# EAGLE design strain (EAGLE 9.2.2)
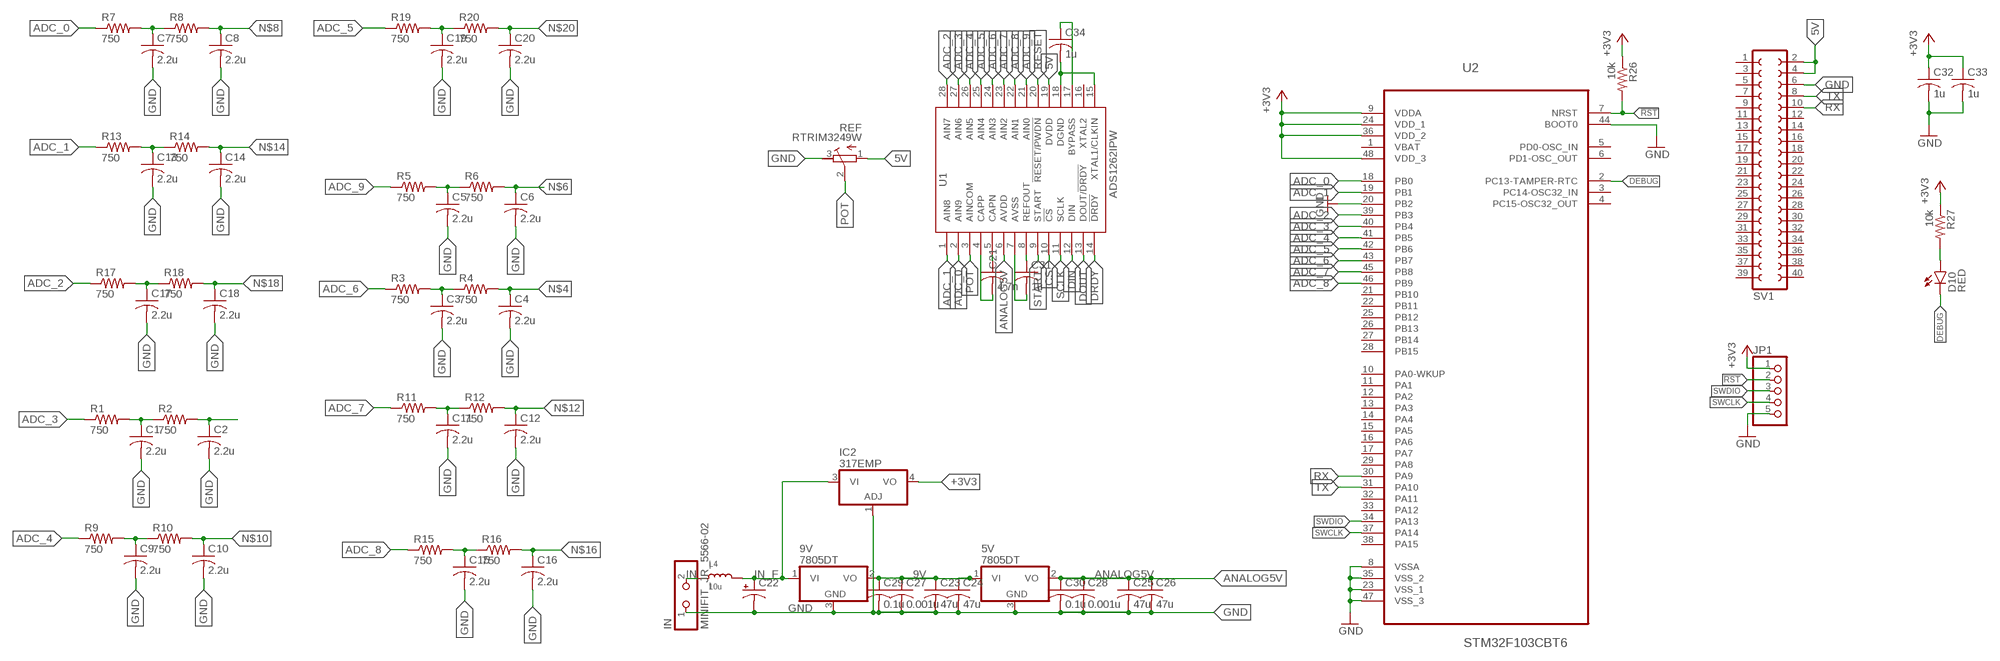
[diagram p0: schematic, sheet 1]

## Parts
5V  7805DT  [TO252]
9V  7805DT  [TO252]
C1  2.2u  C-USC0805  [C0805]
C2  2.2u  C-USC0805  [C0805]
C3  2.2u  C-USC0805  [C0805]
C4  2.2u  C-USC0805  [C0805]
C5  2.2u  C-USC0805  [C0805]
C6  2.2u  C-USC0805  [C0805]
C7  2.2u  C-USC0805  [C0805]
C8  2.2u  C-USC0805  [C0805]
C9  2.2u  C-USC0805  [C0805]
C10  2.2u  C-USC0805  [C0805]
C11  2.2u  C-USC0805  [C0805]
C12  2.2u  C-USC0805  [C0805]
C13  2.2u  C-USC0805  [C0805]
C14  2.2u  C-USC0805  [C0805]
C15  2.2u  C-USC0805  [C0805]
C16  2.2u  C-USC0805  [C0805]
C17  2.2u  C-USC0805  [C0805]
C18  2.2u  C-USC0805  [C0805]
C19  2.2u  C-USC0805  [C0805]
C20  2.2u  C-USC0805  [C0805]
C21  4.7n  C-USC0805  [C0805]
C22  CPOL-USE5-10.5  [E5-10,5]
C23  47u  C-USC1210  [C1210]
C24  47u  C-USC1210  [C1210]
C25  47u  C-USC1210  [C1210]
C26  47u  C-USC1210  [C1210]
C27  0.001u  C-USC0603  [C0603]
C28  0.001u  C-USC0603  [C0603]
C29  0.1u  C-USC0603  [C0603]
C30  0.1u  C-USC0603  [C0603]
C31  1u  C-USC0805  [C0805]
C32  1u  C-USC0805  [C0805]
C33  1u  C-USC0805  [C0805]
C34  1u  C-USC0805  [C0805]
D10  RED  LED-RED0603  [LED-0603]
IC2  317EMP  [SOT223]
IN  MINIFIT_JR_5566-02  [MINIFIT_JR_5566-02]
JP1  PINHD-1X5  [1X05]
L4  10u  INDUCTORNR5040  [INDUCTOR_5X5MM_NR5040_NOTHERMALS]
R1  750  R-US_R0805  [R0805]
R2  750  R-US_R0805  [R0805]
R3  750  R-US_R0805  [R0805]
R4  750  R-US_R0805  [R0805]
R5  750  R-US_R0805  [R0805]
R6  750  R-US_R0805  [R0805]
R7  750  R-US_R0805  [R0805]
R8  750  R-US_R0805  [R0805]
R9  750  R-US_R0805  [R0805]
R10  750  R-US_R0805  [R0805]
R11  750  R-US_R0805  [R0805]
R12  750  R-US_R0805  [R0805]
R13  750  R-US_R0805  [R0805]
R14  750  R-US_R0805  [R0805]
R15  750  R-US_R0805  [R0805]
R16  750  R-US_R0805  [R0805]
R17  750  R-US_R0805  [R0805]
R18  750  R-US_R0805  [R0805]
R19  750  R-US_R0805  [R0805]
R20  750  R-US_R0805  [R0805]
R26  10k  R-US_R0603  [R0603]
R27  10k  R-US_R0603  [R0603]
REF  RTRIM3249W  [RTRIM3299W]
SV1  FE20-2  [FE20-2]
U1  ADS1262IPW  [TSSOP28]
U2  STM32F103CBT6  [QFP50P900X900X160-48N]

## Nets
5V: REF.1(A) SV1.2 SV1.4 U1.19(DVDD)
9V: 5V.1(VI) 9V.2(VO) C23.1 C24.1 C27.1 C29.1
!RST: JP1.2 R26.2 U2.7(NRST)
+3V3 [PWR]: C32.1 C33.1 IC2.4(VO) JP1.1 R26.1 R27.1 U2.9(VDDA) U2.24(VDD_1) U2.36(VDD_2) U2.48(VDD_3)
ADC_0: R7.1 U1.2(AIN9) U2.18(PB0)
ADC_1: R13.1 U1.1(AIN8) U2.19(PB1)
ADC_2: R17.1 U1.28(AIN7) U2.39(PB3)
ADC_3: R1.1 U1.27(AIN6) U2.40(PB4)
ADC_4: R9.1 U1.26(AIN5) U2.41(PB5)
ADC_5: R19.1 U1.25(AIN4) U2.42(PB6)
ADC_6: R3.1 U1.24(AIN3) U2.43(PB7)
ADC_7: R11.1 U1.23(AIN2) U2.45(PB8)
ADC_8: R15.1 U1.22(AIN1) U2.46(PB9)
ADC_9: R5.1 U1.21(AIN0)
ANALOG5V: 5V.2(VO) C25.1 C26.1 C28.1 C30.1 U1.6(AVDD)
CS: U1.10(!CS)
DEBUG: D10.C U2.2(PC13-TAMPER-RTC)
DGND: C34.2 U1.15(XTAL1/CLKIN) U1.18(DGND)
DIN: U1.12(DIN)
DOUT: U1.13(DOUT/!DRDY)
DRDY: U1.14(!DRDY)
GND: 5V.3(GND) 9V.3(GND) C1.2 C2.2 C3.2 C4.2 C5.2 C6.2 C7.2 C8.2 C9.2 C10.2 C11.2 C12.2 C13.2 C14.2 C15.2 C16.2 C17.2 C18.2 C19.2 C20.2 C22.- C23.2 C24.2 C25.2 C26.2 C27.2 C28.2 C29.2 C30.2 C32.2 C33.2 IC2.1(ADJ) IN.1 JP1.5 REF.3(E) SV1.6 U2.8(VSSA) U2.20(PB2) U2.23(VSS_1) U2.35(VSS_2) U2.44(BOOT0) U2.47(VSS_3)
IN: IN.2 L4.P$1
IN_F: 9V.1(VI) C22.+ IC2.3(VI) L4.P$2
N$1: C1.1 R1.2 R2.1
N$2: C2.1 R2.2
N$3: C3.1 R3.2 R4.1
N$4: C4.1 R4.2
N$5: C5.1 R5.2 R6.1
N$6: C6.1 R6.2
N$7: C7.1 R7.2 R8.1
N$8: C8.1 R8.2
N$9: C9.1 R9.2 R10.1
N$10: C10.1 R10.2
N$11: C11.1 R11.2 R12.1
N$12: C12.1 R12.2
N$13: C13.1 R13.2 R14.1
N$14: C14.1 R14.2
N$15: C15.1 R15.2 R16.1
N$16: C16.1 R16.2
N$17: C17.1 R17.2 R18.1
N$18: C18.1 R18.2
N$19: C19.1 R19.2 R20.1
N$20: C20.1 R20.2
N$21: D10.A R27.2
N$22: C21.1 C21.2 U1.4(CAPP) U1.5(CAPN)
N$23: C31.1 U1.8(REFOUT)
N$24: C31.2 U1.7(AVSS)
N$25: C34.1 U1.17(BYPASS)
POT: REF.2(S) U1.3(AINCOM)
RESET: U1.20(!RESET/PWDN)
RX: SV1.10 U2.30(PA9)
SCLK: U1.11(SCLK)
START: U1.9(START)
SWCLK: JP1.4 U2.37(PA14)
SWDIO: JP1.3 U2.34(PA13)
TX: SV1.8 U2.31(PA10)
Unconnected: SV1.1 SV1.3 SV1.5 SV1.7 SV1.9 SV1.11 SV1.12 SV1.13 SV1.14 SV1.15 SV1.16 SV1.17 SV1.18 SV1.19 SV1.20 SV1.21 SV1.22 SV1.23 SV1.24 SV1.25 SV1.26 SV1.27 SV1.28 SV1.29 SV1.30 SV1.31 SV1.32 SV1.33 SV1.34 SV1.35 SV1.36 SV1.37 SV1.38 SV1.39 SV1.40 U1.16(XTAL2) U2.1(VBAT) U2.3(PC14-OSC32_IN) U2.4(PC15-OSC32_OUT) U2.5(PD0-OSC_IN) U2.6(PD1-OSC_OUT) U2.10(PA0-WKUP) U2.11(PA1) U2.12(PA2) U2.13(PA3) U2.14(PA4) U2.15(PA5) U2.16(PA6) U2.17(PA7) U2.21(PB10) U2.22(PB11) U2.25(PB12) U2.26(PB13) U2.27(PB14) U2.28(PB15) U2.29(PA8) U2.33(PA12) U2.38(PA15)

## Power pins joined to a net without a drawn wire
PA11: U2.32(PA11)

## Library data of the parts
5V 9V = linear:78*: Positive VOLTAGE REGULATOR Source: http://cache.national.com/ds/LM/LM78L05.pdf http://www.fairchildsemi.com/ds/LM/LM7805.pdf
C1-C21 C23-C34 = rcl:C-US: CAPACITOR, American symbol; SPICEPREFIX: C
C22 = rcl:CPOL-US: POLARIZED CAPACITOR, American symbol; SPICEPREFIX: C
D10 = SparkFun-LED:LED-RED: Assorted Red LEDs LilyPad 1206- DIO-09912 1206- DIO-00809 0603- DIO-00819 "SMART" means more efficient and expensive; PROD_ID: DIO-00819
IC2 = linear:*317: Positive VOLTAGE REGULATOR
IN = Display_Custom:MINIFIT_JR_5566-02: Molex Minifit JR 5566-02 Vertical 2 position headder https://www.molex.com/pdm_docs/sd/039293026_sd.pdf
JP1 = Headers_IFE:PINHD-1X5: PIN HEADER
L4 = microbuilder:INDUCTOR: Inductors 0603: 10nH Ceramic Inductor - microwire antenna/RF (Digikey: 712-1434-2-ND) 0805: 560nH Ceramic Inductor - RF (Digikey: 553-1047-1-ND) 270nH Ceramic Inductor - Q = 40@250MHz, +-5%, 1 Ohm DC Resistance (Digikey: 535-10506-2-ND) 1007 (2518 Metric) SMT: 10µH 10% 250mOhm 820mA 1007 Inductor (Digikey: 587-2189-1-ND) 22µH 10% 500mOhm 580mA 1007 Inductor (Digikey: 587-2190-1-ND) 47µH 10% 950mOhm 420mA 1007 Inductor (Digikey: 587-2191-1-ND) 47µH 5% 100mOhm 1A 1008 Inductor (Digikey: 732-1816-1-ND) 5.0x5.0mm (Taiyo Yuden NR5040 Series) 6.8µH 20% 2.3A 64mOhm Inductor (Digikey: 587-2374-2-ND) 5.0x5.0mm (TDK VLC5045 Series) 4.7µH 20% 3.3A 34mOhm Inductor (Digikey: 445-6526-1-ND) 6.8µH 20% 2.7A 46mOhm Inductor (Digikey: 445-6527-1-ND) 6.0x6.0mm (TDK VLC6045 Series) 4.7µH 20% 3.8A 27mOhm Inductor (Digikey: 445-6538-2-ND) 6.8µH 20% 3A 41mOhm Inductor (Digikey: 445-6540-1-ND) 6.2µH 30% 2.2A 45mOhm Inductor (Digikey: SRR5028-6R2YCT-ND) - Not TDK VLC6045 but footprint should match 6.0x6.0mm (TDK SLF6045 Series) 6.8uH 30% 2A 33mOhm Inductor (Digikey: 445-4572-1-ND, Mouser: 810-SLF645T6R8N2R0PF) 6.0x6.0mm (Sumida CDRH5D28 Series) 6.2uH 30% 1.8A 45mOhm Inductor (Digikey: 308-1542-1-ND) Taiyo Yuden NR3015T2R2M - 2.2uH 20% 1.5A (Digikey: 587-1648-2-ND, Mouser: 963-NR3015T2R2M) - Used with TI TPS62172 CoilCraft RFID Transponder Coil - MA5532-AE (For use with AS3935 Lightning Sensor)
R1-R20 R26 R27 = rcl:R-US_: RESISTOR, American symbol; SPICEPREFIX: R
REF = Resistors:RTRIM3249W
SV1 = con-lsta:FE20-2: FEMALE HEADER; OC_FARNELL: unknown; OC_NEWARK: unknown
U1 = ads1262:ADS1262: ADS126x 32-Bit, Precision, 38-kSPS, Analog-to-Digital Converter (ADC) with Programmable Gain Amplifier (PGA) and Voltage Reference Texas Instruments selon http://www.ti.com/lit/gpn/ads1262 by HN2015
U2 = ST Microelctronics_By_element14_Batch_1:STM32F103CBT6: Medium-density performance line ARM-based 32-bit MCU; MPN: STM32F103CBT6; OC_FARNELL: 1606327; OC_NEWARK: 11N8296; PACKAGE: QFP-48; SUPPLIER: STMICROELECTRONICS

## Net classes
1 PWR: width 0.254 mm

## Board
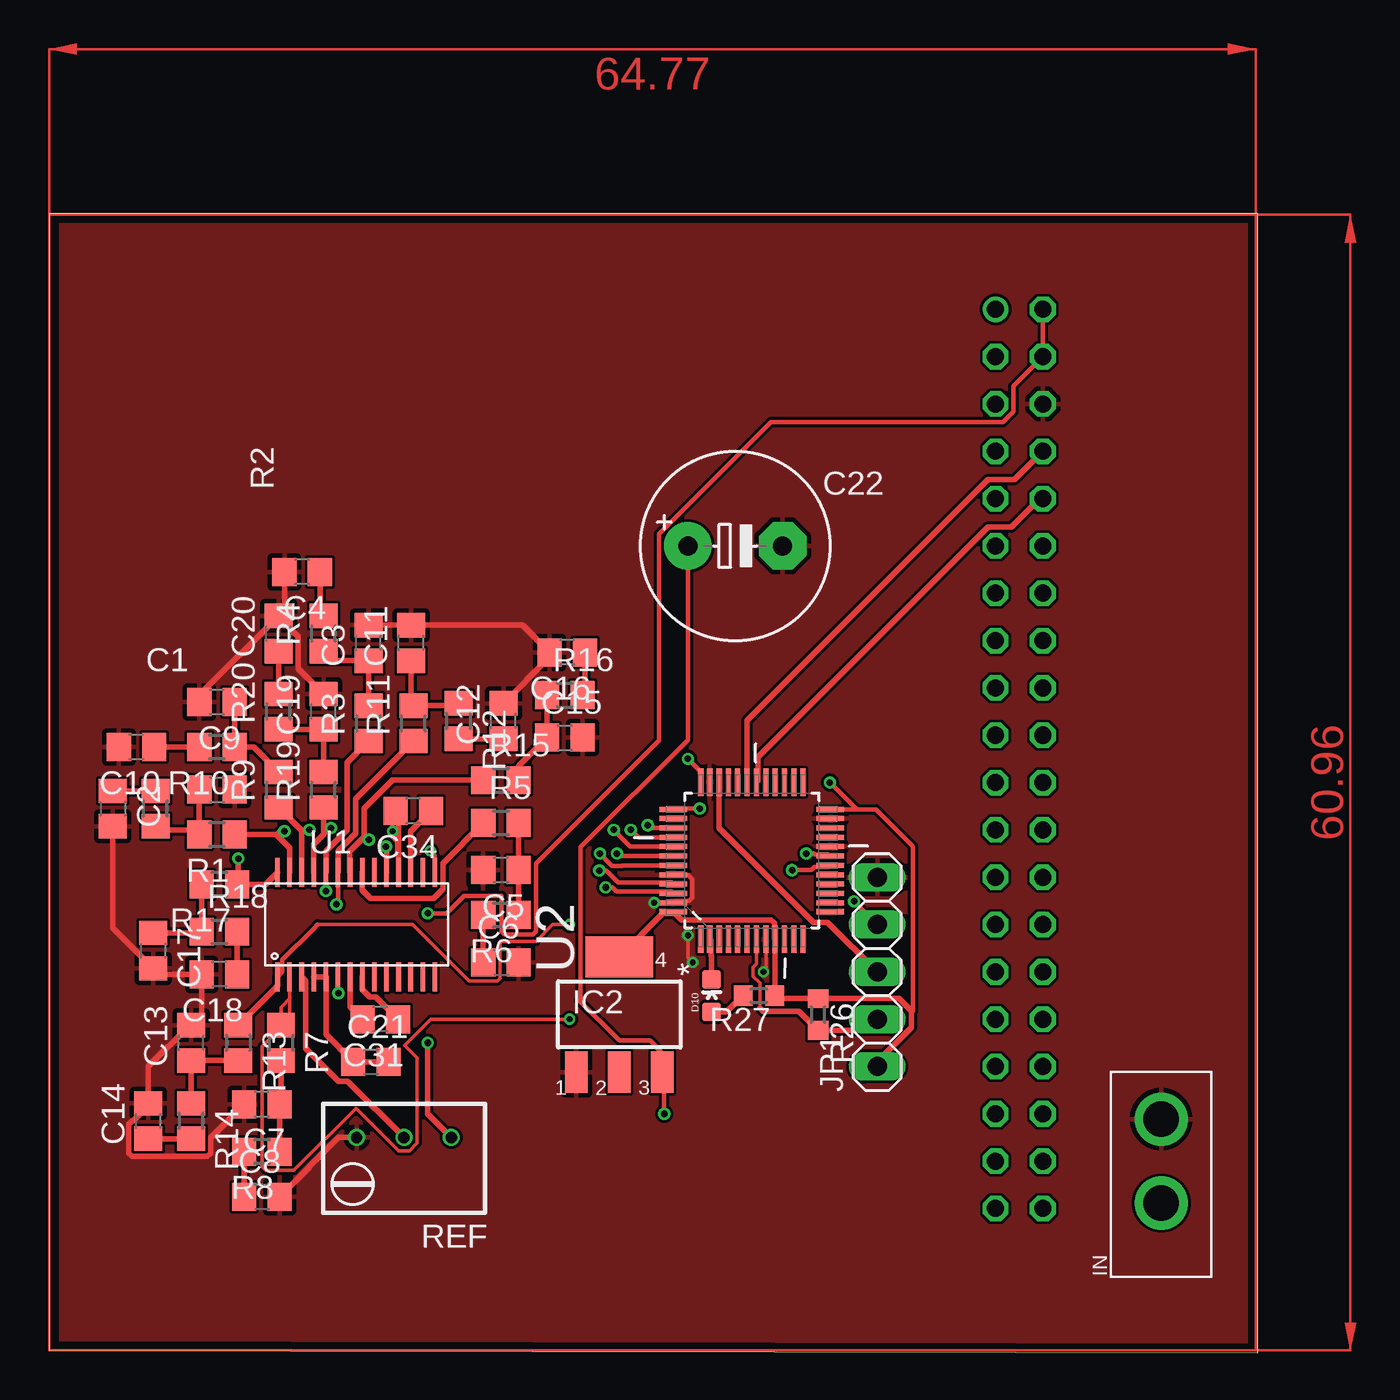
[diagram p1: board, top side]
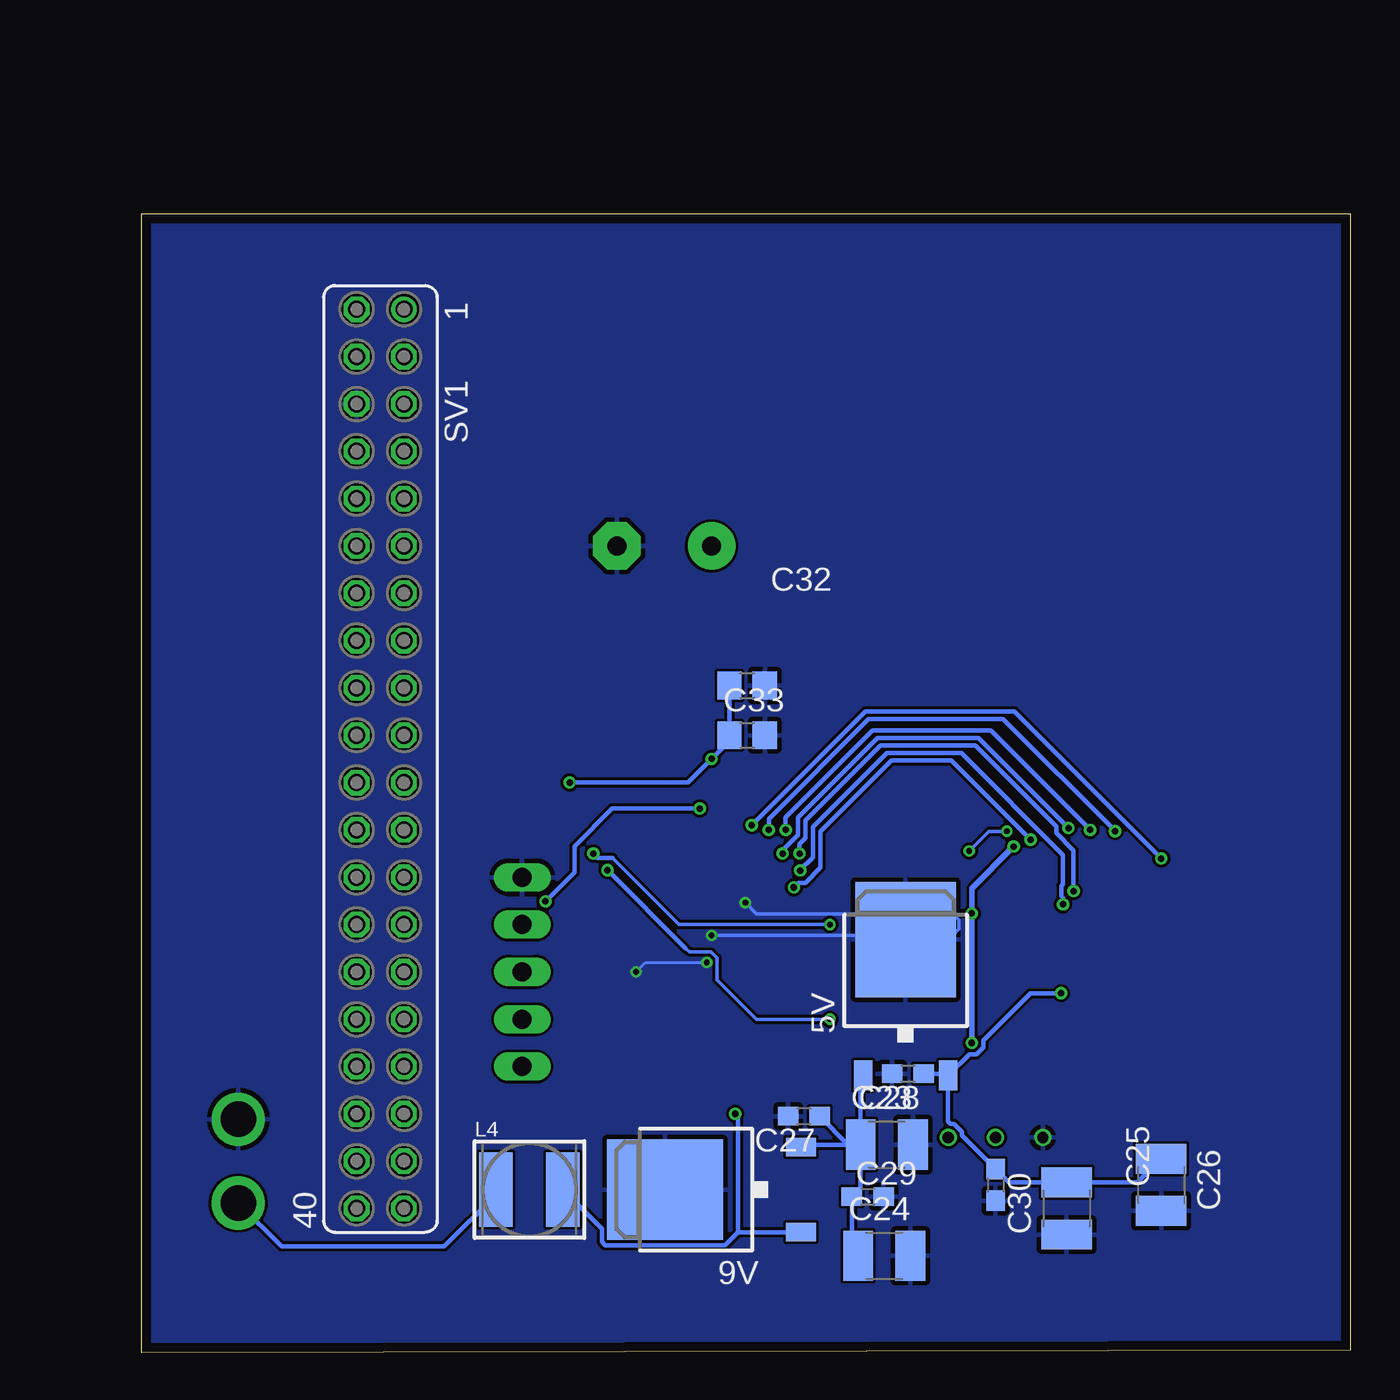
[diagram p2: board, bottom side, seen from below]

Size 64.88 x 61.14 mm. Coordinates in mm from the lower left corner, seen from the top.
Outline: 0,0.13 64.88,0 64.88,61.14 0,61.14 0,0.13
Copper layers (1*16): Top 0.035mm / dielectric 1.6mm / Bottom 0.035mm
Design rules "Elecrow_2-layer_PCB_eagle_rule": minimum track width 6mil, minimum drill 12mil, track to track 6mil, track to pad 6mil, pad to pad 6mil, via to via 8mil, smd to smd 0mil, copper to edge 20mil, drill to drill 10mil, minimum pad ring 6mil, minimum via ring 6mil, stop-mask expansion 0mil, vias tented up to drill 100mil, thermal gap 10mil

### Footprints (pad centres in the part's own frame; a part is rotated, then mirrored left to right if it is on the bottom)
TO252 = smd 1 x 1.6: 1 -2.28,-4.8; 2 2.28,-4.8 | smd 5.4 x 6.2: 3 0,2.5
C0805 = smd 1.3 x 1.5: 1 -0.95,0; 2 0.95,0
E5-10,5 = drill 1.016 pad 2.54: + -2.54,0 | drill 1.016 pad 2.54 octagon: - 2.54,0
C1210 = smd 1.6 x 2.7: 1 -1.4,0; 2 1.4,0
C0603 = smd 1.1 x 1: 1 -0.85,0; 2 0.85,0
LED-0603 = smd 1 x 1: A 0,-0.877; C 0,0.877
SOT223 = smd 1.219 x 2.235: 1 -2.311,-3.099; 2 0,-3.099; 3 2.311,-3.099 | smd 3.6 x 2.2: 4 0,3.099
MINIFIT_JR_5566-02 = drill 1.9: 1 0,2.25; 2 0,-2.25
1X05 = drill 1.016 long: 1 -5.08,0; 2 -2.54,0; 3 0,0; 4 2.54,0; 5 5.08,0
INDUCTOR_5X5MM_NR5040_NOTHERMALS = smd 1.8 x 4: P$1 -1.8,0; P$2 1.8,0
R0805 = smd 1.3 x 1.5: 1 -0.95,0; 2 0.95,0
R0603 = smd 1 x 1.1: 1 -0.85,0; 2 0.85,0
RTRIM3299W = drill 0.61: 1 1.27,-2.54; 2 1.27,0; 3 1.27,2.54
FE20-2 = drill 0.914: 1 -24.13,1.27 | drill 0.914 octagon: 2 -24.13,-1.27; 3 -21.59,1.27; 4 -21.59,-1.27; 5 -19.05,1.27; 6 -19.05,-1.27; 7 -16.51,1.27; 8 -16.51,-1.27; 9 -13.97,1.27; 10 -13.97,-1.27; 11 -11.43,1.27; 12 -11.43,-1.27; 13 -8.89,1.27; 14 -8.89,-1.27; 15 -6.35,1.27; 16 -6.35,-1.27; 17 -3.81,1.27; 18 -3.81,-1.27; 19 -1.27,1.27; 20 -1.27,-1.27; 21 1.27,1.27; 22 1.27,-1.27; 23 3.81,1.27; 24 3.81,-1.27; 25 6.35,1.27; 26 6.35,-1.27; 27 8.89,1.27; 28 8.89,-1.27; 29 11.43,1.27; 30 11.43,-1.27; 31 13.97,1.27; 32 13.97,-1.27; 33 16.51,1.27; 34 16.51,-1.27; 35 19.05,1.27; 36 19.05,-1.27; 37 21.59,1.27; 38 21.59,-1.27; 39 24.13,1.27; 40 24.13,-1.27
TSSOP28 = smd 0.25 x 1.55: 1 -4.25,-2.8; 2 -3.6,-2.8; 3 -2.95,-2.8; 4 -2.3,-2.8; 5 -1.65,-2.8; 6 -1,-2.8; 7 -0.35,-2.8; 8 0.3,-2.8; 9 0.95,-2.8; 10 1.6,-2.8; 11 2.25,-2.8; 12 2.9,-2.8; 13 3.55,-2.8; 14 4.2,-2.8; 15 4.2,2.8; 16 3.55,2.8; 17 2.9,2.8; 18 2.25,2.8; 19 1.6,2.8; 20 0.95,2.8; 21 0.3,2.8; 22 -0.35,2.8; 23 -1,2.8; 24 -1.65,2.8; 25 -2.3,2.8; 26 -2.95,2.8; 27 -3.6,2.8; 28 -4.25,2.8
QFP50P900X900X160-48N = smd 1.473 x 0.279: 1 -4.216,2.743; 2 -4.216,2.261; 3 -4.216,1.753; 4 -4.216,1.245; 5 -4.216,0.762; 6 -4.216,0.254; 7 -4.216,-0.254; 8 -4.216,-0.762; 9 -4.216,-1.245; 10 -4.216,-1.753; 11 -4.216,-2.261; 12 -4.216,-2.743; 25 4.216,-2.743; 26 4.216,-2.261; 27 4.216,-1.753; 28 4.216,-1.245; 29 4.216,-0.762; 30 4.216,-0.254; 31 4.216,0.254; 32 4.216,0.762; 33 4.216,1.245; 34 4.216,1.753; 35 4.216,2.261; 36 4.216,2.743 | smd 0.279 x 1.473: 13 -2.743,-4.216; 14 -2.261,-4.216; 15 -1.753,-4.216; 16 -1.245,-4.216; 17 -0.762,-4.216; 18 -0.254,-4.216; 19 0.254,-4.216; 20 0.762,-4.216; 21 1.245,-4.216; 22 1.753,-4.216; 23 2.261,-4.216; 24 2.743,-4.216; 37 2.743,4.216; 38 2.261,4.216; 39 1.753,4.216; 40 1.245,4.216; 41 0.762,4.216; 42 0.254,4.216; 43 -0.254,4.216; 44 -0.762,4.216; 45 -1.245,4.216; 46 -1.753,4.216; 47 -2.261,4.216; 48 -2.743,4.216

### Placement (x,y rotation side)
5V  23.88,19.68 0 bottom
9V  34.29,8.76 90 bottom
C1  9.02,30.23 0 top
C2  3.43,29.21 270 top
C3  17.14,38.1 90 top
C4  13.59,41.91 180 top
C5  24.26,25.91 180 top
C6  24.26,20.95 0 top
C7  11.43,13.34 180 top
C8  11.43,8.38 0 top
C9  9.02,34.93 180 top
C10  4.7,32.51 180 top
C11  19.43,38.1 90 top
C12  24.38,33.91 90 top
C13  7.62,16.64 90 top
C14  5.33,12.45 90 top
C15  27.69,33.02 0 top
C16  27.81,37.59 180 top
C17  5.59,21.59 270 top
C18  9.14,20.32 180 top
C19  14.73,34.42 90 top
C20  12.32,38.61 90 top
C21  17.27,15.62 0 top
C22  36.83,43.31 0 top
C23  24.89,11.18 0 bottom
C24  25.02,5.21 0 bottom
C25  15.24,7.75 270 bottom
C26  10.16,9.02 270 bottom
C27  29.34,12.7 180 bottom
C28  23.75,14.99 180 bottom
C29  25.91,8.38 0 bottom
C30  19.05,9.02 270 bottom
C31  17.78,17.91 180 top
C32  32.38,35.81 0 bottom
C33  32.38,33.15 0 bottom
C34  19.56,29.08 180 top
D10  35.56,19.18 0 top
IC2  30.61,18.16 0 top
IN  59.69,10.29 0 top
JP1  44.45,20.45 90 top
L4  44.07,8.76 0 bottom
R1  9.02,27.81 180 top
R2  5.71,29.21 90 top
R3  17.14,33.78 90 top
R4  14.73,38.61 90 top
R5  24.26,28.45 0 top
R6  24.26,23.49 180 top
R7  12.45,16.64 270 top
R8  11.43,10.79 180 top
R9  12.32,30.23 90 top
R10  9.02,32.51 180 top
R11  19.56,33.78 90 top
R12  21.97,33.91 270 top
R13  10.16,16.64 270 top
R14  7.62,12.45 270 top
R15  24.26,30.73 0 top
R16  27.69,35.31 0 top
R17  9.14,25.15 180 top
R18  9.14,22.61 0 top
R19  14.73,30.23 90 top
R20  12.32,34.42 90 top
R26  41.27,18.16 270 top
R27  38.1,19.18 180 top
REF  19.05,10.29 90 top
SV1  52.07,31.88 270 bottom
U1  16.51,22.99 0 top
U2  37.72,26.42 90 top

### Tracks (layer width: path | path; a pad name or v marks a point on that pad's centre or on a via)
5V  (via drill 0.35)
  Top 0.254: SV1.2 SV1.4 51.77,51.89 51.77,50.53 51.2,49.96 38.75,49.96 32.74,43.95 32.74,32.87 26.14,26.26 26.14,22.63 25.97,22.47 24.44,22.47 24.28,22.63 24.28,24.52 22.27,24.52 21.34,23.59 v20.32,23.59
  Top 0.3: REF.1 20.32,12.83 v20.32,16.64 | v18.08,27.18 18.11,27.15 U1.19
  Bottom 0.3: v20.32,16.64 v20.32,23.59 20.32,24.94 v18.08,27.18
9V
  Bottom 0.254: C23.1 26.29,8.85 C29.1 26.76,5.55 C24.1 | 9V.2 29.36,11.18 C23.1 | C23.1 26.29,14.75 5V.1 | C27.1 26.96,11.18 C23.1
!RST
  Top 0.2: 38.15,18.5 38.15,19.85 37.79,20.22 37.79,20.68 37.97,20.86 U2.7
  Top 0.3: 38.15,18.5 38.33,18.32 40.26,18.32 R26.2 43.85,17.31 JP1.2
+3V3  (via drill 0.35)
  Top 0.254: U2.24 43.36,29.16 | 46.28,18.29 46.35,18.37 46.35,27.18 44.37,29.16 43.36,29.16 | v34.29,31.88 34.98,31.19 U2.36 | v41.91,30.61 43.36,29.16
  Top 0.3: 33.6,23.57 33.94,23.24 38.75,23.24 38.92,23.06 38.92,22.24 U2.9 R27.1 39.12,19.01 R26.1 45.61,19.01 46.28,18.35 46.28,18.29 46.28,17.47 44.45,15.64 JP1.1 | 33.6,23.57 U2.48 | IC2.4 32.92,23.57 33.6,23.57
  Bottom 0.254: C32.1 C33.1 33.34,32.83 v34.29,31.88 35.56,30.61 v41.91,30.61
ADC_0  (via drill 0.3, 0.35)
  Top 0.2: 12.17,17.17 12.91,17.91 U1.2 12.91,19.09 12.95,19.05 12.45,18.54 R7.1 12.17,17.31 12.17,17.17 | 12.17,17.17 11.44,16.44 11.44,9.97 11.62,9.79 13.13,9.79 16.47,13.13 18.76,10.85 19.34,10.85 19.76,11.26 19.76,15.84 19.09,16.51 20.49,17.91 v27.94,17.91
  Top 0.25: U2.18 41.84,26.07 41.08,26.07 40.92,25.91 v39.88,25.91
  Bottom 0.2: v27.94,17.91 31.88,17.91 33.99,20.02 33.99,21.19 34.31,21.51 35.48,21.51 35.69,21.72
  Bottom 0.25: 35.69,21.72 v39.88,25.91
ADC_1  (via drill 0.3, 0.35)
  Top 0.2: v27.94,22.99 27.03,22.99 26.13,22.09 24.21,22.09 24.21,20.1 24.06,19.95 22.55,19.95 19.52,22.99 14.42,22.99
  Top 0.25: U1.1 12.51,20.43 12.51,21.08 14.19,22.76 14.42,22.99 | v40.64,26.8 41.05,26.8 41.08,26.76 41.84,26.76 U2.19
  Top 0.3: R13.1 12.26,19.69 U1.1
  Bottom 0.2: v27.94,22.99 36.03,22.99 39.61,26.56
  Bottom 0.25: v40.64,26.8 40.41,26.56 39.61,26.56
ADC_2  (via drill 0.35)
  Top 0.25: v32.13,28.32 32.28,28.17 U2.39
  Top 0.3: U1.28 11.62,25.15 R17.1 10.16,25.21 v10.16,26.53
  Bottom 0.25: v10.16,26.53 18.05,34.42 26.04,34.42 v32.13,28.32
ADC_3  (via drill 0.35)
  Top 0.25: 12.19,27.81 12.38,28 v12.63,28 | v31.22,28.07 31.63,27.66 U2.40
  Top 0.3: U1.27 12.91,27.09 12.19,27.81 R1.1
  Bottom 0.25: v12.63,28 18.65,34.02 25.87,34.02 31.22,28.66 v31.22,28.07
ADC_4  (via drill 0.35)
  Top 0.25: 13.56,28.04 13.94,28.04 v13.97,28.07 | v30.31,28.07 30.57,27.81 30.57,27.79 31.18,27.18 U2.41
  Top 0.3: R9.1 13.56,28.04 U1.26
  Bottom 0.25: v13.97,28.07 19.3,33.4 25.65,33.4 30.31,28.74 v30.31,28.07
ADC_5  (via drill 0.35)
  Top 0.25: 14.73,27.81 15.09,28.17 v15.14,28.17 | v30.48,26.8 30.61,26.67 U2.42
  Top 0.3: R19.1 14.73,27.81 14.21,27.29 U1.25
  Bottom 0.25: v15.14,28.17 19.97,33 25.4,33 29.66,28.74 29.66,27.79 30.48,26.97 v30.48,26.8
ADC_6  (via drill 0.35)
  Top 0.25: U1.24 v14.86,24.79 | v29.57,26.8 29.82,26.54 29.82,26.52 30.21,26.14 30.75,26.14 30.77,26.16 U2.43
  Top 0.3: R3.1 16,31.69 16,28.07 14.86,26.92 U1.24
  Bottom 0.25: v14.86,24.79 14.86,26.96 15.79,27.9 15.79,28.25 20.14,32.6 25.23,32.6 29.25,28.57 29.25,27.63 29.57,27.31 v29.57,26.8
ADC_7  (via drill 0.35)
  Top 0.25: U1.23 15.51,25.06 15.52,25.06 15.52,24.16 v15.43,24.07 | v29.53,25.89 29.89,25.89 30.54,25.24 33.44,25.24 U2.45
  Top 0.3: R11.1 16.45,29.73 16.45,27.88 15.51,26.93 U1.23
  Bottom 0.25: v15.43,24.07 15.43,24.43 15.52,24.52 15.52,25.06 15.43,25.15 15.43,26.73 20.89,32.19 24.89,32.19 28.85,28.23 28.85,26.59 29.53,25.91 v29.53,25.89
ADC_8  (via drill 0.35)
  Top 0.25: 16.91,28.07 16.91,27.81 v17.17,27.55 | v29.87,24.98 30.23,24.98 30.46,24.75 33.41,24.75 U2.46
  Top 0.3: R15.1 18.43,30.73 16.91,29.21 16.91,28.07 16.91,27.69 16.13,26.92 16.13,25.81 U1.22
  Bottom 0.25: v17.17,27.55 21.42,31.79 24.64,31.79 28.45,27.98 28.45,26.04 29.26,25.23 29.62,25.23 v29.87,24.98
ADC_9
  Top 0.3: R5.1 21.14,26.28 21.14,24.89 20.64,24.38 17.27,24.38 16.81,24.85 U1.21
ANALOG5V  (via drill 0.35)
  Top 0.254: v15.53,19.3 15.53,20.17 U1.6
  Bottom 0.254: v15.53,19.3 17.18,19.3 19.71,16.77 19.71,16.39 20.07,16.03 20.45,16.03 5V.2 | C26.1 11.43,9.15 C25.1 18.33,9.15 C30.1 20.85,11.67 20.85,11.86 21.29,12.29 21.48,12.29 21.6,12.41 5V.2 | C28.1 21.7,14.99 5V.2
DEBUG
  Top 0.3: D10.C 35.56,21.3 35.52,21.34 35.52,22.13 U2.2
DGND  (via drill 0.3)
  Top 0.2: v18.44,28 18.44,27.63 18.66,27.42 18.66,26.9 18.76,26.8 | v20.46,26.93 20.71,26.68 U1.15
  Top 0.3: C34.2 18.76,28.93 18.76,26.8 U1.18
  Bottom 0.2: v18.44,28 19.4,28 v20.46,26.93
GND  (via drill 0.3)
  Top 0.152: U2.8 38.48,20.58 v38.34,20.45
  Top 0.2: v34.54,20.95 34.29,21.21 v34.29,22.4 | v32.48,24.17 33.49,24.17 U2.47
  Top 0.254: U2.44 33.52,25.64 34.3,25.64 34.52,25.43 34.52,24.41 34.35,24.24 33.59,24.24 U2.47
  Top 0.3: C7.2 8.67,11.53 8.67,10.72 8.49,10.54 4.46,10.54 4.28,10.72 4.28,12.27 4.46,12.45 4.51,12.45 5.39,13.34 C14.2 5.33,15.37 7.55,17.59 C13.2 8.19,18.16 C18.2 5.91,20.32 C17.2 3.43,22.8 C2.2 | C12.2 26.86,37.34 C16.2 25.41,39.05 C11.2 C3.2 | C19.2 13.37,36.73 13.37,38.43 12.32,39.49 C20.2 | C20.2 8.07,35.31 C9.2 | C4.2 12.64,39.88 C20.2 | C8.2 15.55,11.56 REF.3
  Bottom 0.152: v38.34,20.45 37.84,20.95 v34.54,20.95
  Bottom 0.2: v34.29,22.4 34.24,22.4 34.24,22.41 21.35,22.41 21.01,22.75 21.01,23.23 21.35,23.57 31.87,23.57 v32.48,24.17
  pour Top: 0,61.09 64.77,61.09 64.77,0.13 0,0.13
  pour Bottom: 0,61.09 64.77,61.09 64.77,0.13 0,0.13
IN
  Bottom 0.254: IN.2 57.37,5.71 48.64,5.71 45.87,8.49 L4.P$1
IN_F  (via drill 0.35)
  Top 0.254: v33.02,12.83 33.02,14.96 | 33.02,14.96 IC2.3 | C22.+ 34.29,32.9 28.53,27.14 28.53,19 28.45,18.92 30.61,16.76 32.26,16.76 33.02,16 33.02,14.96
  Bottom 0.254: L4.P$2 40.17,6.66 40.17,5.95 40.01,5.78 33.57,5.78 32.88,6.48 | 9V.1 32.88,6.48 | 32.88,6.48 32.88,12.68 v33.02,12.83
N$1
  Top 0.3: C1.1 R1.2 7.81,28.07 5.91,28.07 R2.1
N$2
  Top 0.3: C2.1 R2.2
N$3
  Top 0.3: R3.2 C3.1 15.24,37.15 R4.1
N$4
  Top 0.3: C4.1 14.54,39.75 R4.2
N$5
  Top 0.3: R5.2 C5.1 R6.1
N$6
  Top 0.3: C6.1 R6.2
N$7
  Top 0.3: R7.2 12.45,13.4 C7.1 R8.1
N$8
  Top 0.3: R8.2 C8.1
N$9
  Top 0.3: R9.2 10.98,32.51 R10.1 C9.1
N$10
  Top 0.3: C10.1 R10.2
N$11
  Top 0.3: R12.1 21.84,34.73 R11.2 19.43,34.86 C11.1
N$12
  Top 0.3: R12.2 C12.1
N$13
  Top 0.3: R13.2 C13.1 R14.1
N$14
  Top 0.3: R14.2 C14.1
N$15
  Top 0.3: R16.1 C15.1 25.21,31.49 R15.2
N$16
  Top 0.3: R16.2 28.76,35.43 C16.1
N$17
  Top 0.3: R17.2 R18.1 8.13,22.54 C17.1
N$18
  Top 0.3: R18.2 C18.1
N$19
  Top 0.3: R19.2 C19.1 R20.1
N$20
  Top 0.3: R20.2 C20.1
N$21
  Top 0.3: D10.A 36.37,18.3 R27.2
N$22
  Top 0.3: U1.4 U1.5 14.86,17.08 C21.1 C21.2
N$23
  Top 0.3: C31.1 17.53,19.11 17.21,19.11 16.81,19.51 U1.8
N$24
  Top 0.3: C31.2 16.16,18.58 U1.7
N$25
  Top 0.3: C34.1 19.41,27.98 U1.17
POT
  Top 0.3: U1.3 13.78,19.96 13.78,16.33 15.55,14.57 16.04,14.57 REF.2
RX
  Top 0.3: SV1.10 53.19,45.85 51.66,44.32 50.38,44.32 38.04,31.98 38.04,30.7 U2.30
SWCLK  (via drill 0.35)
  Top 0.25: JP1.4 v43.2,24.23 | v34.92,29.21 33.55,29.21 U2.37
  Bottom 0.25: v43.2,24.23 41.66,25.78 41.66,27.18 39.62,29.21 v34.92,29.21
SWDIO
  Top 0.3: JP1.3 41.78,23.11 41.02,23.11 35.97,28.17 U2.34
TX
  Top 0.3: SV1.8 51.81,46.86 50.38,46.86 37.47,33.95 U2.31
(copper drawn outside any net)
  shapes: Top area x2

### Text on the board
silk_top: IFE 2018 / ADS1262 BOARD / HARRIS MOHAMED